# EasyEDA schematic SCH_TRANSMITTER-WITH-ATMEGA328-VER-1.2_2026-09-10.json
TITLE: 6CHANNEL TRANSMITTER; REV: 2.1; Date: 2023-04-30; Sheet: 1/1; Drawn By: northernstar; Company: Northern Electronics Company
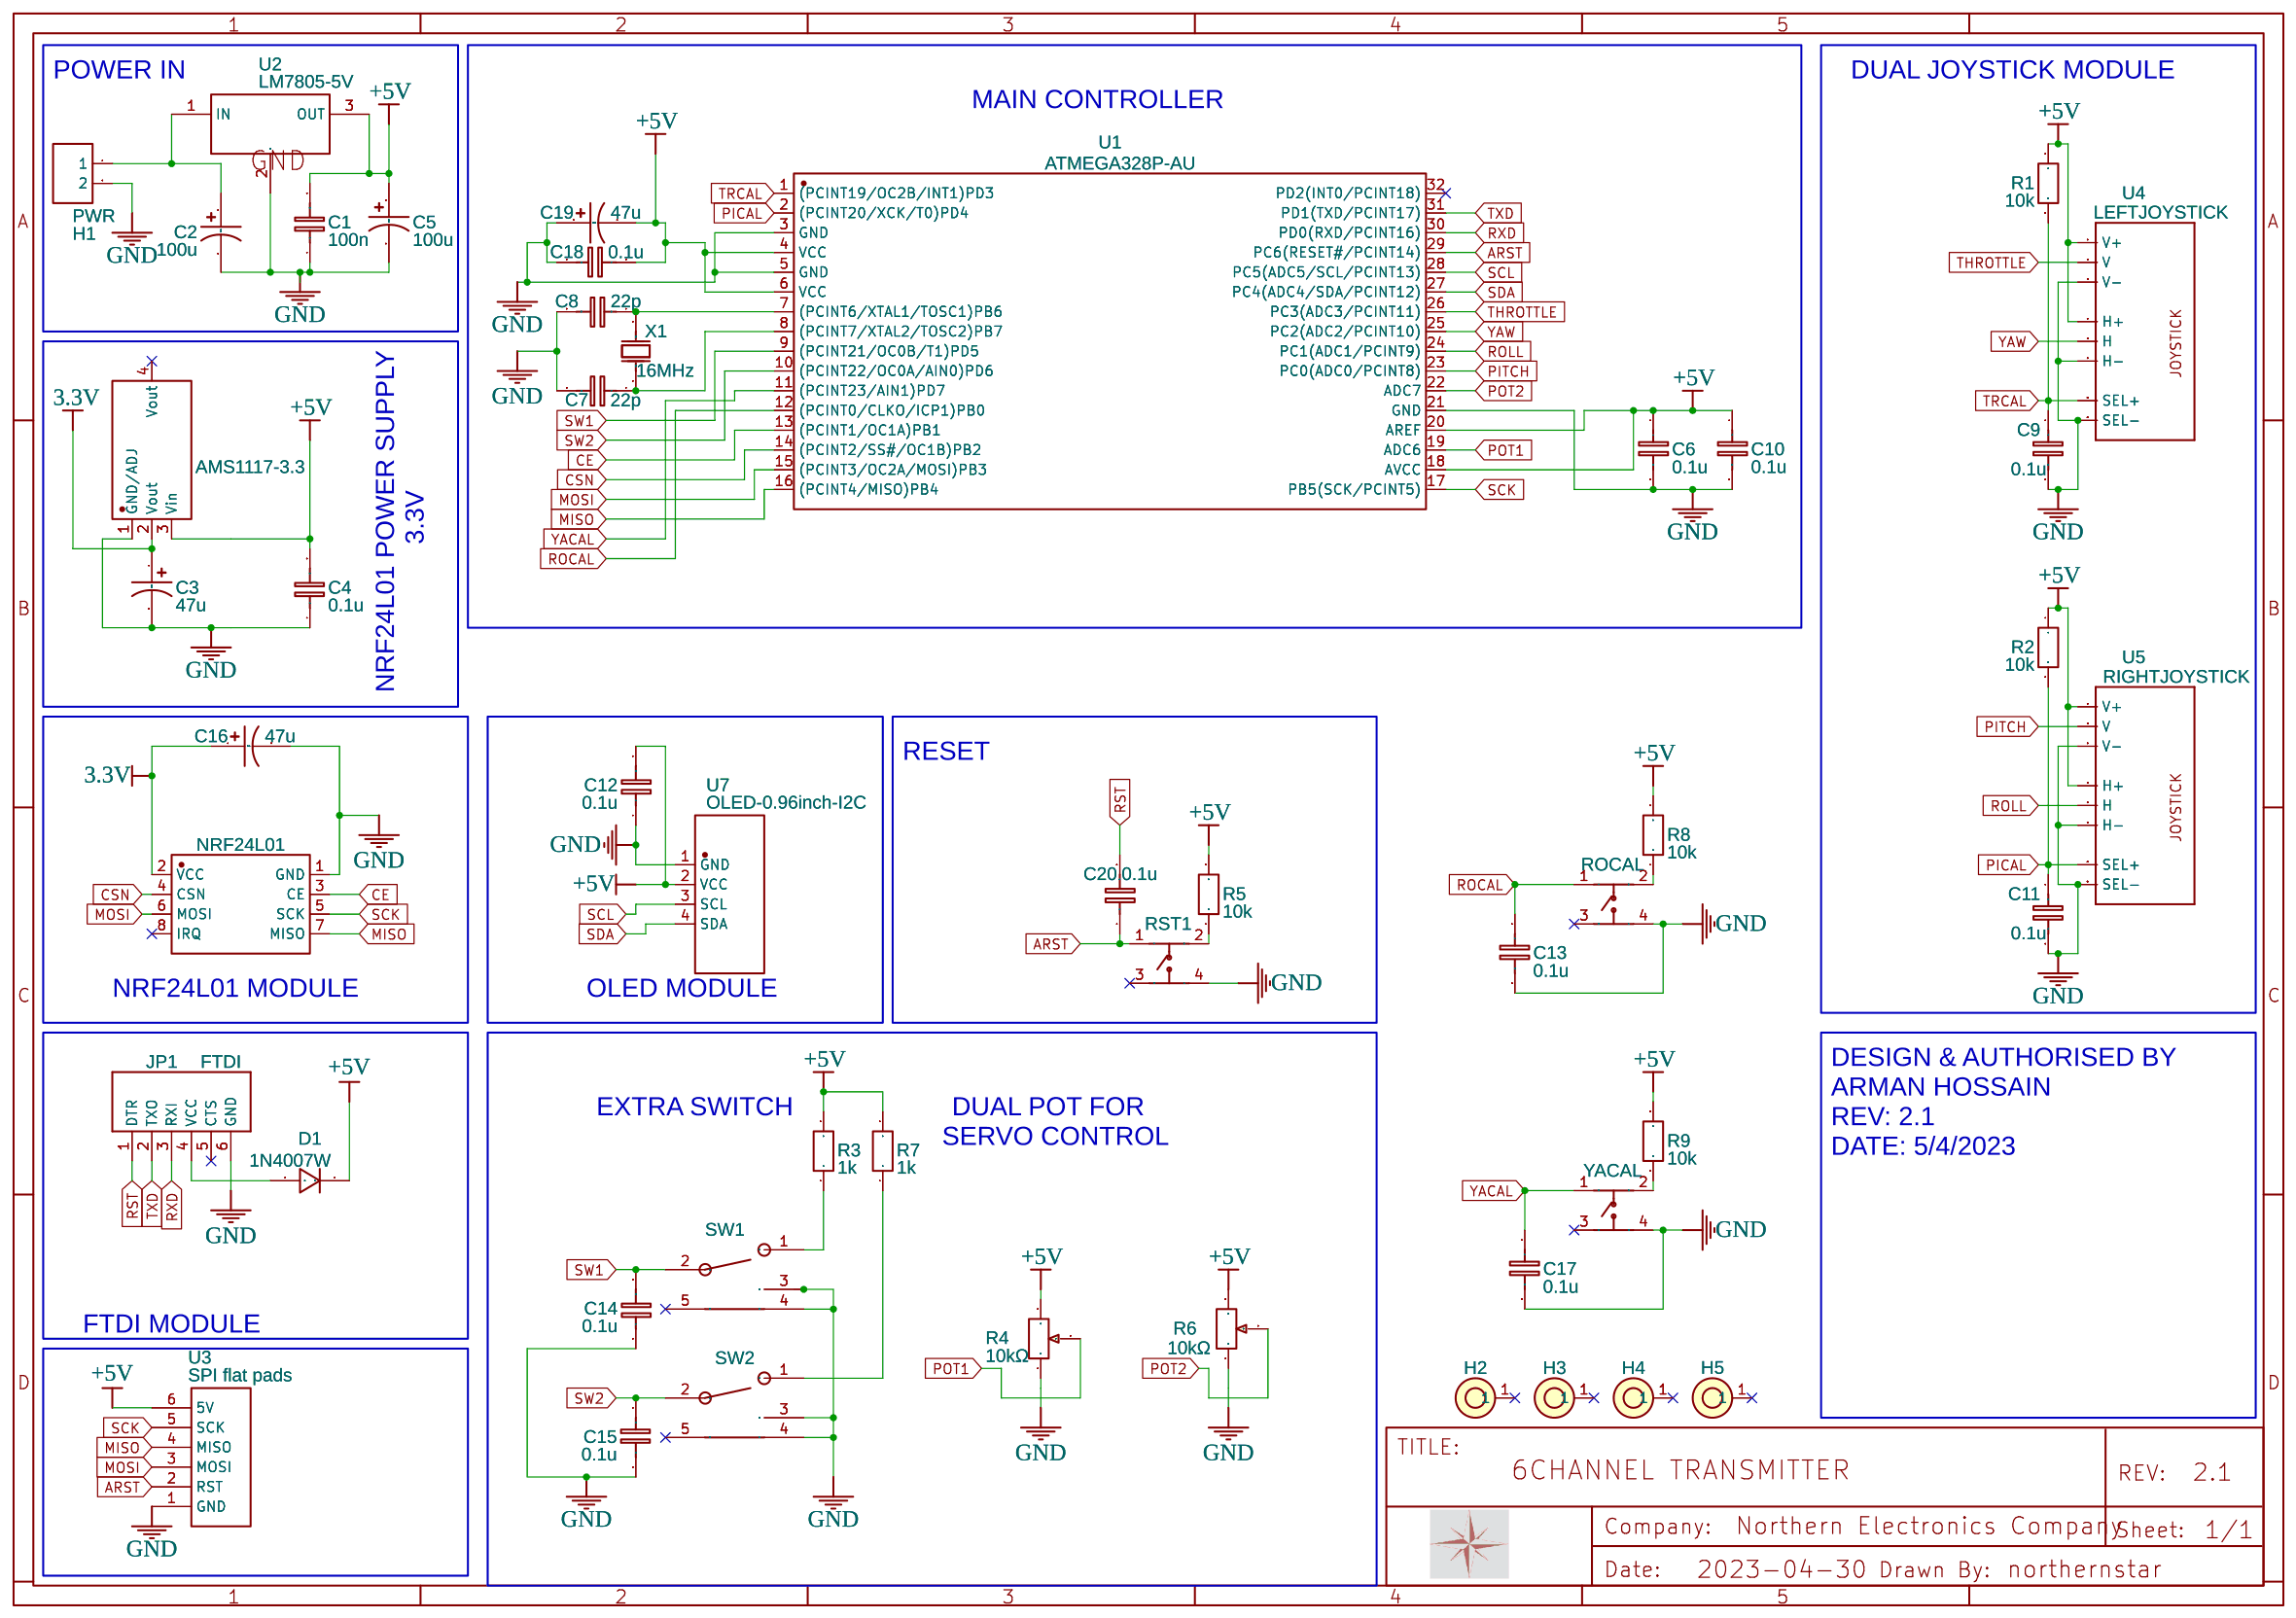
[diagram p0: schematic sheet]

## Parts
C1  100n  [RAD-0.2]
C2  100u  [CAP-D5.0×F2.0]
C3  47u  [CAP-D5.0×F2.0]
C4  0.1u  [C1206]
C5  100u  [CAP-D5.0×F2.0]
C6  0.1u  [C1206]
C7  22p  [RAD-0.2]
C8  22p  [RAD-0.2]
C9  0.1u  [C1206]
C10  0.1u  [C1206]
C11  0.1u  [C1206]
C12  0.1u  [C1206]
C13  0.1u  [C1206]
C14  0.1u  [C1206]
C15  0.1u  [C1206]
C16  47u  [CAP-D5.0×F2.0]
C17  0.1u  [C1206]
C18  0.1u  [C1206]
C19  47u  [CAP-D5.0×F2.0]
C20  0.1u  [C1206]
D1  1N4007W  [SOD-123_L2.8-W1.8-LS3.7-RD]
H1  PWR  [HDR-F-2.54_1X2]
H2  M3 HOLE PLATED  [M3 HOLE PLATED]
H3  M3 HOLE PLATED  [M3 HOLE PLATED]
H4  M3 HOLE PLATED  [M3 HOLE PLATED]
H5  M3 HOLE PLATED  [M3 HOLE PLATED]
JP1  FTDI  [FTDI]
MK1  NRF24L01  [WIRELM-SMD_NRF24L01]
NO1  AMS1117-3.3  [SOT-223-3_L6.5-W3.4-P2.30-LS7.0-BR]
R1  10k  [R1206]
R2  10k  [R1206]
R3  1k  [R1206]
R4  10kΩ  [A10K]
R5  10k  [R1206]
R6  10kΩ  [A10K]
R7  1k  [R1206]
R8  10k  [R1206]
R9  10k  [R1206]
ROCAL  TSD001A08526A  [SW-TH_4P-L6.0-W6.0-P4.50-LS6.3]
RST1  TSD001A08526A  [SW-TH_4P-L6.0-W6.0-P4.50-LS6.3]
SW1  SW  [SW-TH_100SP3T2B4M6RE]
SW2  100SP3T2B4M6RE  [SW-TH_100SP3T2B4M6RE]
U1  ATMEGA328P-AU  [TQFP-32_L7.0-W7.0-P0.80-LS9.0-BL]
U2  LM7805-5V  [TO-252-2_L6.6-W6.1-P4.58-LS9.9-TL]
U3  SPI flat pads  [SPI FLAT PADS]
U4  LEFTJOYSTICK  [JOYSTICK]
U5  RIGHTJOYSTICK  [JOYSTICK]
U7  OLED-0.96inch-I2C  [DISPLAY-OLED-128X64-I2C]
X1  16MHz  [OSC-TH_L10.0-W4.5-P5.00]
YACAL  TSD001A08526A  [SW-TH_4P-L6.0-W6.0-P4.50-LS6.3]

## Library data of the parts
C1 C7 C8 = C_RAD-0.2_EU: Contributor: LCEDA_Lib
C2 C3 C5 C16 C19 = CE_TH_D5.0×F2.0_US: Contributor: LCEDA_Lib
C4 C6 C9-C15 C17 C18 C20 = C_1206_EU: Contributor: LCEDA_Lib
D1 = 1N4007W: Supplier: LCSC; Supplier Part: C328592; Manufacturer: BLUE ROCKET; Contributor: LCEDA_Lib
H1 = HDR-F-2.54_1x2: Supplier Part: C49661; Supplier: LCSC; Contributor: LCEDA_Lib
H2-H5 = M3 HOLE PLATED: Contributor: Zdravko Kreže
JP1 = FTDI: Contributor: Marvinno Technologies
MK1 = NRF24L01: Supplier: LCSC; Manufacturer: Ai-Thinker(安信可); Manufacturer Part: NF-04; Supplier Part: C90751; JLCPCB Part Class: Extended Part
NO1 = AMS1117-3.3-YJLTY: Supplier: LCSC; Supplier Part: C9900003397; JLCPCB Part Class: Extended Part; Contributor: LCSC; Manufacturer: null
R1-R3 R5 R7-R9 = R_1206_EU: Contributor: LCEDA_Lib
R4 R6 = A10K: Supplier: LCSC; Supplier Part: C231749; Manufacturer: ALPSALPINE(阿尔卑斯阿尔派); Manufacturer Part: RK16312A0BKH; link: https://atta.szlcsc.com/upload/public/pdf/source/20180613/C231749_F0A00B2AA60C42757A3F15B1E5114770.pdf; Contributor: northernstar; JLCPCB Part Class: Extended Part
ROCAL RST1 YACAL = TSD001A08526A: Supplier: LCSC; Supplier Part: C2888552; Manufacturer: BZCN(博众电气); Contributor: LCSC
SW1 SW2 = 100SP3T2B4M6RE: Supplier: LCSC; Supplier Part: C273357; Manufacturer: E-Switch; Contributor: LCSC; JLCPCB Part Class: Extended Part
U1 = ATMEGA328P-AU_C2851158: Supplier: LCSC; Supplier Part: C2851158; Manufacturer: null; JLCPCB Part Class: Extended Part; Contributor: LCSC
U2 = LM7805-5V: Supplier: LCSC; Supplier Part: C9900008050; Manufacturer: null; Contributor: LCSC; JLCPCB Part Class: Extended Part
U3 = SPI flat pads: Contributor: Emerick Herve
U4 U5 = JOYSTICKPTH: Contributor: roman_cb
U7 = OLED-0.96inch-I2C: Supplier: Digi-Key; Supplier Part: AZDelivery; Manufacturer: AZDelivery; Manufacturer Part: ZJY096S0700BG01蓝色; link: https://img.jlc.com/pdf/applyPasteComponent/2022-08-15/203417A/337c2d88c1b34c958220578f8c1ccd46/ZJY096S0700WG01.pdf; Contributor: northernstar
X1 = X49SD16MSD2SC: Supplier: LCSC; Manufacturer: YXC(扬兴晶振); Supplier Part: C16212; JLCPCB Part Class: Extended Part

## Nets
3.3V: C3.1 C16.1 MK1.2(VCC) NO1.2(Vout)
+5V: C1.2 C4.2 C5.1 C6.1 C10.1 C12.2 C18.2 C19.2 D1.1 NO1.3(Vin) R1.1 R2.1 R3.2 R4.3 R5.2 R6.3 R7.2 R8.2 R9.2 U1.4(VCC) U1.6(VCC) U1.18(AVCC) U1.20(AREF) U2.3(OUT) U3.6(5V) U4.H1(H+) U4.V1(V+) U5.H1(H+) U5.V1(V+) U7.2(VCC)
GND: C1.1 C2.2 C3.2 C4.1 C5.2 C6.2 C7.2 C8.2 C9.2 C10.2 C11.2 C12.1 C13.2 C14.1 C15.2 C16.2 C17.2 C18.1 C19.1 H1.2 JP1.6(GND) MK1.1(GND) NO1.1(GND/ADJ) R4.1 R6.1 ROCAL.4 RST1.4 SW1.3 SW1.4 SW2.3 SW2.4 U1.3(GND) U1.5(GND) U1.21(GND) U2.2(GND) U3.1(GND) U4.B2A(SEL-) U4.H3(H-) U4.V3(V-) U5.B2A(SEL-) U5.H3(H-) U5.V3(V-) U7.1(GND) YACAL.4
ARST: C20.1 RST1.1 U1.29(PC6(RESET#/PCINT14)) U3.2(RST)
CE: MK1.3(CE) U1.13((PCINT1/OC1A)PB1)
CSN: MK1.4(CSN) U1.14((PCINT2/SS#/OC1B)PB2)
MISO: MK1.7(MISO) U1.16((PCINT4/MISO)PB4) U3.4(MISO)
MOSI: MK1.6(MOSI) U1.15((PCINT3/OC2A/MOSI)PB3) U3.3(MOSI)
PICAL: C11.1 R2.2 U1.2((PCINT20/XCK/T0)PD4) U5.B1A(SEL+)
PITCH: U1.23(PC0(ADC0/PCINT8)) U5.V2(V)
POT1: R4.2 U1.19(ADC6)
POT2: R6.2 U1.22(ADC7)
ROCAL: C13.1 ROCAL.1 U1.12((PCINT0/CLKO/ICP1)PB0)
ROLL: U1.24(PC1(ADC1/PCINT9)) U5.H2(H)
RST: C20.2 JP1.1(DTR)
RXD: JP1.3(RXI) U1.30(PD0(RXD/PCINT16))
SCK: MK1.5(SCK) U1.17(PB5(SCK/PCINT5)) U3.5(SCK)
SCL: U1.28(PC5(ADC5/SCL/PCINT13)) U7.3(SCL)
SDA: U1.27(PC4(ADC4/SDA/PCINT12)) U7.4(SDA)
SW1: C14.2 SW1.2 U1.9((PCINT21/OC0B/T1)PD5)
SW2: C15.1 SW2.2 U1.10((PCINT22/OC0A/AIN0)PD6)
THROTTLE: U1.26(PC3(ADC3/PCINT11)) U4.V2(V)
TRCAL: C9.1 R1.2 U1.1((PCINT19/OC2B/INT1)PD3) U4.B1A(SEL+)
TXD: JP1.2(TXO) U1.31(PD1(TXD/PCINT17))
YACAL: C17.1 U1.11((PCINT23/AIN1)PD7) YACAL.1
YAW: U1.25(PC2(ADC2/PCINT10)) U4.H2(H)
Net-(C2-1): C2.1 H1.1 U2.1(IN)
Net-(C7-1): C7.1 U1.8((PCINT7/XTAL2/TOSC2)PB7) X1.2(OSC2)
Net-(C8-1): C8.1 U1.7((PCINT6/XTAL1/TOSC1)PB6) X1.1(OSC1)
Net-(D1-2): D1.2 JP1.4(VCC)
Net-(R3-1): R3.1 SW1.1
Net-(R5-1): R5.1 RST1.2
Net-(R7-1): R7.1 SW2.1
Net-(R8-1): R8.1 ROCAL.2
Net-(R9-1): R9.1 YACAL.2

Not connected (* = marked no-connect by the designer): H2 1*; H3 1*; H4 1*; H5 1*; JP1 5(CTS)*; MK1 8(IRQ)*; NO1 4(Vout)*; ROCAL 3*; RST1 3*; SW1 5*; SW2 5*; U1 32(PD2(INT0/PCINT18))*; YACAL 3*

## Notes on the sheet
- POWER IN
- DUAL JOYSTICK MODULE
- MAIN CONTROLLER
- 3.3V
- NRF24L01 POWER SUPPLY
- RESET
- NRF24L01 MODULE
- OLED MODULE
- DESIGN & AUTHORISED BY
- ARMAN HOSSAIN
- EXTRA SWITCH
- DUAL POT FOR
- REV: 2.1
- SERVO CONTROL
- DATE: 5/4/2023
- FTDI MODULE
